# Altium project SCB.PrjPCB (part 6 of 6)
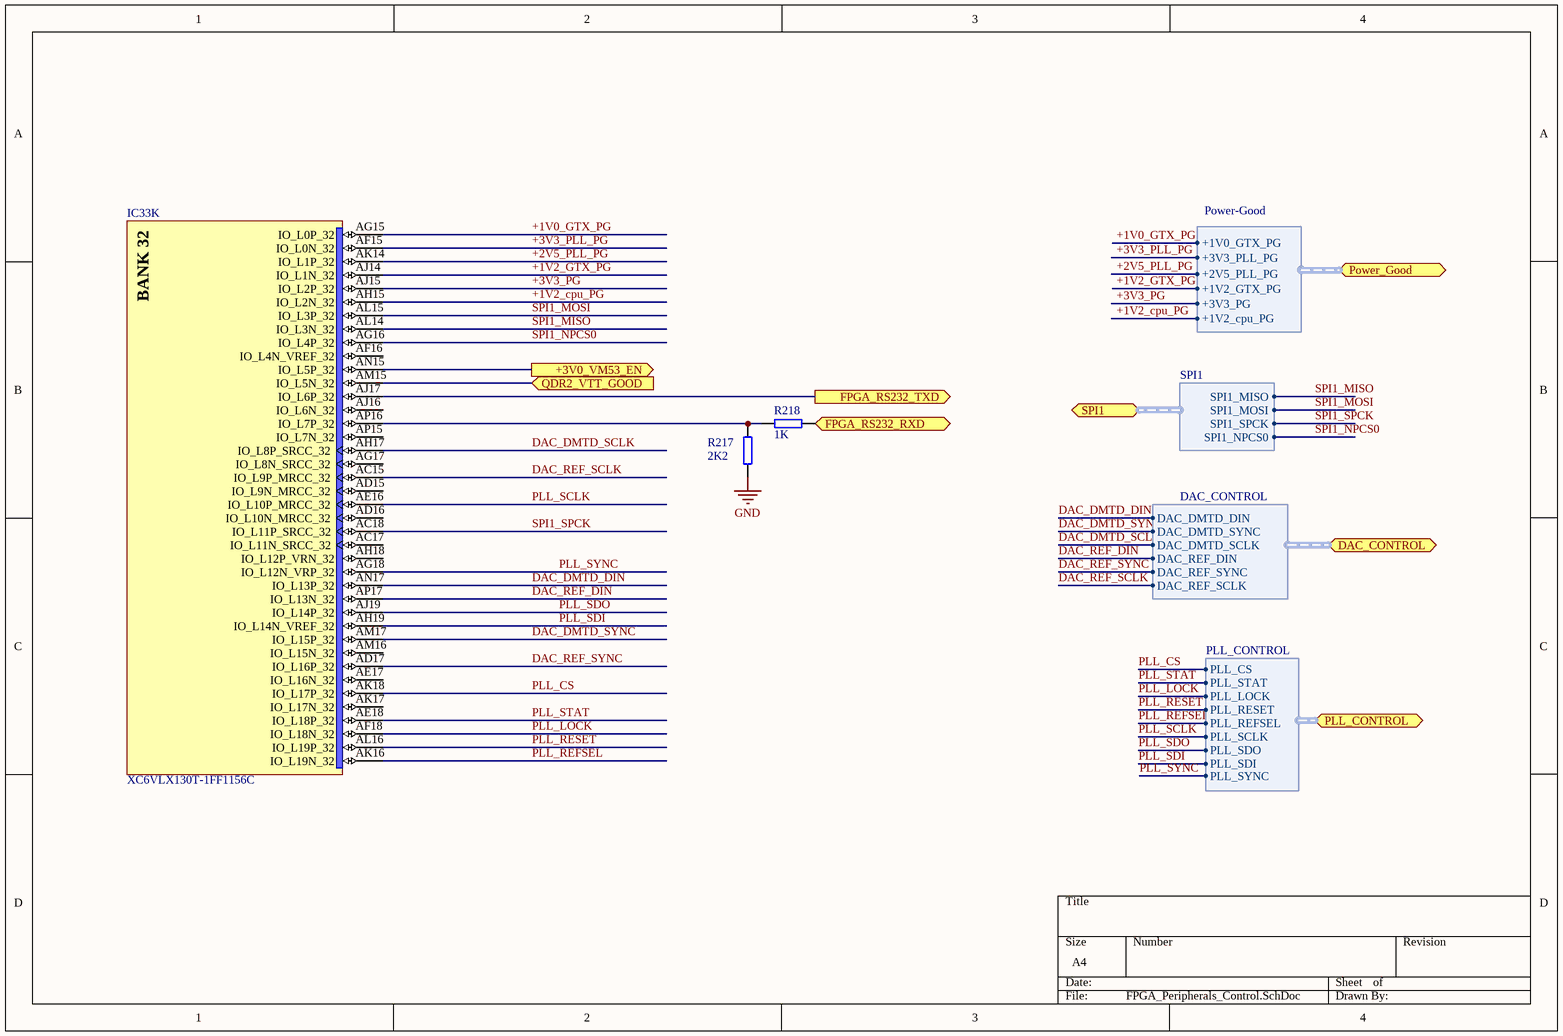
[diagram p23: FPGA_Peripherals_Control.SchDoc]

## Nets that join several sheets
+1V0: Power_Supply (10 pins), FPGA_POWER_DGND (65 pins)
+1V0_GTX: FPGA_GTX (36 pins), FPGA_System_Monitor (R126.2), Power_Supply (C311.2 C312.2 IC39.8 R205.2)
+1V2_cpu: CPU_JTAG_Power_PLL (8 pins), FPGA_System_Monitor (R107.2), Power_Supply (C285.2 C286.2 IC37.8 R198.2)
+1V2_GTX: FPGA_GTX (39 pins), FPGA_System_Monitor (R117.2), Power_Supply (C246.2 C247.2 IC32.8 R180.2)
+1V5: FPGA_System_Monitor (R106.2), Power_Supply (13 pins)
+1V8: CPU_JTAG_Power_PLL (7 pins), CPU_100M_Ethernet (8 pins), External WatchDogs (C28.2 IC3.10 R16.2), FPGA_Configuration (C62.2 C63.2 IC36.A6 IC36.H3), FPGA_System_Monitor (R138.2), Power_Supply (9 pins), FPGA_POWER_DGND (42 pins), QDRII_mem (IC42.P6 IC42.R6 IC43.P6 IC43.R6), QDRII_power (104 pins), FPGA_QDRII (R95.2 R97.2)
+2V5: Connectors (5 pins), SMI_Link_7-12 (J3.29 J3.31), External WatchDogs (R17.2 R18.2 R19.2), FPGA_Configuration (23 pins), CPU_IO_Ports (C217.2 IC24.2 IC24.10), FPGA_System_Monitor (R128.2 R129.2), Power_Supply (24 pins), FPGA_POWER_DGND (55 pins), QDRII_power (C417.1 IC45.7 IC45.10 R214.2)
+2V5_PLL: SCB_PLLs (7 pins), Power_Supply (C263.2 C264.2 IC34.8 R188.1)
+3V0_OSC: SCB_CLKs (5 pins), Power_Supply (C235.2 IC38.5)
+3V0_VM53: SCB_CLKs (C33.1 C35.1 IC4.4 IC23.4), Power_Supply (C236.2 IC44.5)
+3V3: Connectors (6 pins), CPU_JTAG_Power_PLL (24 pins), RS232_and_USB_ports (C242.1 C244.1 IC31.16), SCB_CLKs (19 pins), CPU_100M_Ethernet (L12.2 R201.2), CPU_Memory (40 pins), External WatchDogs (6 pins), CPU_IO_Ports (5 pins), SCB_PLLs (22 pins), FPGA_System_Monitor (12 pins), Power_Supply (11 pins)
+3V3_PLL: SCB_PLLs (27 pins), Power_Supply (C266.2 C267.2 IC35.8 R189.1)
+5VCC_IN: Connectors (17 pins), Power_Supply (42 pins)
GND: Connectors (67 pins), CPU_JTAG_Power_PLL (53 pins), RS232_and_USB_ports (6 pins), SCB_CLKs (51 pins), FPGA_CPU_EBI1 (R182.1), FPGA_GTX (41 pins), CPU_100M_Ethernet (R187.2 R192.2), CPU_Memory (36 pins), SMI_Link_7-12 (J3.33 J3.34 J3.35 J3.36), uTCA_Tongue3 (58 pins), External WatchDogs (8 pins), FPGA_Configuration (18 pins), CPU_IO_Ports (C217.1 C218.1 D14.2 IC24.11), SCB_PLLs (82 pins), FPGA_System_Monitor (27 pins), Power_Supply (114 pins), FPGA_POWER_DGND (275 pins), QDRII_mem (IC42.R2 IC43.R2), QDRII_power (139 pins), FPGA_QDRII (R94.2 R96.2), FPGA_Peripherals_Control (R217.2)
GND_ETH: Connectors (CN1.9 CN1.12), CPU_100M_Ethernet (26 pins)
QDRII_VTT: QDRII_mem (28 pins), QDRII_power (37 pins)
VREFQDRII: QDRII_power (11 pins), FPGA_QDRII (8 pins)
+1V0_GTX_PG: Power_Supply (IC39.2 R207.2), FPGA_Peripherals_Control (IC33.AG15)
+1V2_cpu_PG: Power_Supply (IC37.2 IC47.24 IC48.4 R195.1), FPGA_Peripherals_Control (IC33.AH15)
+1V2_GTX_PG: Power_Supply (IC32.2 R181.2), FPGA_Peripherals_Control (IC33.AJ14)
+2V5_PLL_PG: Power_Supply (IC34.2 R190.2), FPGA_Peripherals_Control (IC33.AK14)
+3V0_VM53_EN: Power_Supply (IC44.3 R211.1), FPGA_Peripherals_Control (IC33.AN15)
+3V3_PG: Power_Supply (IC48.2 R239.2), FPGA_Peripherals_Control (IC33.AJ15)
+3V3_PLL_PG: Power_Supply (IC35.2 R191.2), FPGA_Peripherals_Control (IC33.AF15)
ARM_DMARQ: FPGA_Configuration (IC33.AC22 R52.2), CPU_IO_Ports (IC1#1.H16)
ARM_FPGA_RESET: FPGA_Configuration (IC33.M10 R184.2), CPU_IO_Ports (IC1#1.E17)
ARM_IRQ: FPGA_Configuration (IC33.AC24 R53.2), CPU_IO_Ports (IC1#1.K15)
ARM_NRST: CPU_JTAG_Power_PLL (D6.1 D6.2), FPGA_Configuration (IC33.AD22 R51.2)
ARM_PROGRAM_B: FPGA_Configuration (D10.2), CPU_IO_Ports (IC1#1.L16)
ARM_WD_RST: CPU_JTAG_Power_PLL (D5.1), External WatchDogs (IC2.4 S1.1)
CLK125MHZ_EXT_N: SCB_CLKs (IC9.6 R23.2), SCB_PLLs (C179.1)
CLK125MHZ_EXT_P: SCB_CLKs (IC9.7 R24.2), SCB_PLLs (C182.1)
CLK_25MHz: SCB_CLKs (IC21.5 IC22.3), SCB_PLLs (IC14.21)
CPU_JTAG.JNRST: Connectors (P6.15), CPU_JTAG_Power_PLL (D5.3 D6.3 IC1#1.V15 R11.1)
CPU_JTAG.JNTRST: Connectors (P6.3), CPU_JTAG_Power_PLL (IC1#1.U16 R3.1 R7.1)
CPU_JTAG.JRTCK: Connectors (P6.11), CPU_JTAG_Power_PLL (IC1#1.U15 R10.1)
CPU_JTAG.JTCK: Connectors (P6.9), CPU_JTAG_Power_PLL (IC1#1.R17)
CPU_JTAG.JTDI: Connectors (P6.5), CPU_JTAG_Power_PLL (IC1#1.P17 R8.1)
CPU_JTAG.JTDO: Connectors (P6.13), CPU_JTAG_Power_PLL (IC1#1.N18)
CPU_JTAG.JTMS: Connectors (P6.7), CPU_JTAG_Power_PLL (IC1#1.N17 R9.1)
CPU_SSC.RD1: Connectors (J2.23), CPU_IO_Ports (IC1#1.J13)
CPU_SSC.RF1: Connectors (J2.27), CPU_IO_Ports (IC1#1.J12)
CPU_SSC.RK1: Connectors (J2.25), CPU_IO_Ports (IC1#1.J14)
CPU_SSC.TD1: Connectors (J2.21), CPU_IO_Ports (IC1#1.J18)
CPU_SSC.TF1: Connectors (J2.17), CPU_IO_Ports (IC1#1.J16)
CPU_SSC.TK1: Connectors (J2.19), CPU_IO_Ports (IC1#1.J17)
DAC_CONTROL.DAC_DMTD_DIN: SCB_CLKs (R148.2), FPGA_Peripherals_Control (IC33.AN17)
DAC_CONTROL.DAC_DMTD_SCLK: SCB_CLKs (R149.2), FPGA_Peripherals_Control (IC33.AH17)
DAC_CONTROL.DAC_DMTD_SYNC: SCB_CLKs (R150.2), FPGA_Peripherals_Control (IC33.AM17)
DAC_CONTROL.DAC_REF_DIN: SCB_CLKs (R21.2), FPGA_Peripherals_Control (IC33.AP17)
DAC_CONTROL.DAC_REF_SCLK: SCB_CLKs (R140.2), FPGA_Peripherals_Control (IC33.AC15)
DAC_CONTROL.DAC_REF_SYNC: SCB_CLKs (R141.2), FPGA_Peripherals_Control (IC33.AD17)
DMTD_CLK_N: FPGA_Configuration (IC33.M22), SCB_PLLs (IC13.5)
DMTD_CLK_P: FPGA_Configuration (IC33.L23), SCB_PLLs (IC13.6)
DMTDCLK_mB_N: Connectors (J1.95), SCB_PLLs (IC13.2)
DMTDCLK_mB_P: Connectors (J1.93), SCB_PLLs (IC13.3)
ETH_100MHz.LED_ACT: Connectors (CN1.10), CPU_100M_Ethernet (IC41.3)
ETH_100MHz.LED_LINK: Connectors (CN1.11), CPU_100M_Ethernet (IC41.2 R199.2)
ETH_100MHz.RX_N: Connectors (CN1.6), CPU_100M_Ethernet (Tr1.9)
ETH_100MHz.RX_P: Connectors (CN1.3), CPU_100M_Ethernet (Tr1.11)
ETH_100MHz.SHIELD: Connectors (CN1.0), CPU_100M_Ethernet (C214.1 Tr1.10 Tr1.15)
ETH_100MHz.TX_N: Connectors (CN1.2), CPU_100M_Ethernet (Tr1.14)
ETH_100MHz.TX_P: Connectors (CN1.1), CPU_100M_Ethernet (Tr1.16)
EXT_PROGRAM_B: Connectors (J1.85), FPGA_Configuration (D9.1)
FPGA_25MHZ_CLK_N: SCB_CLKs (IC21.3), FPGA_Configuration (IC33.K23)
FPGA_25MHZ_CLK_P: SCB_CLKs (IC21.4), FPGA_Configuration (IC33.K24)
FPGA_CCLK: FPGA_Configuration (R158.1), CPU_IO_Ports (IC1#1.K16)
FPGA_DIN: FPGA_Configuration (R179.2), CPU_IO_Ports (IC1#1.K18)
FPGA_DONE: Connectors (J1.87), FPGA_Configuration (Q1.3), CPU_IO_Ports (D13.2 IC1#1.L17)
FPGA_GCLK_N: Connectors (J1.91), FPGA_System_Monitor (IC33.E11)
FPGA_GCLK_P: Connectors (J1.89), FPGA_System_Monitor (IC33.D11)
FPGA_GPIO0: Connectors (J2.2), FPGA_GPIOs (IC33.AC25)
FPGA_GPIO1: Connectors (J2.4), FPGA_GPIOs (IC33.AB25)
FPGA_GPIO2: Connectors (J2.6), FPGA_GPIOs (IC33.AF31)
FPGA_GPIO3: Connectors (J2.8), FPGA_GPIOs (IC33.AG31)
FPGA_GPIO4: Connectors (J2.10), FPGA_GPIOs (IC33.AB26)
FPGA_GPIO5: Connectors (J2.12), FPGA_GPIOs (IC33.AA26)
FPGA_GPIO6: Connectors (J2.14), FPGA_GPIOs (IC33.AG32)
FPGA_GPIO7: Connectors (J2.16), FPGA_GPIOs (IC33.AG33)
FPGA_GPIO8: Connectors (J2.18), FPGA_GPIOs (IC33.AC27)
FPGA_GPIO9: Connectors (J2.20), FPGA_GPIOs (IC33.AB27)
FPGA_GPIO10: Connectors (J2.22), FPGA_GPIOs (IC33.AE32)
FPGA_GPIO11: Connectors (J2.24), FPGA_GPIOs (IC33.AD32)
FPGA_GPIO12: Connectors (J2.26), FPGA_GPIOs (IC33.AC28)
FPGA_GPIO13: Connectors (J2.28), FPGA_GPIOs (IC33.AB28)
FPGA_GPIO14: Connectors (J2.30), FPGA_GPIOs (IC33.AC32)
FPGA_GPIO15: Connectors (J2.32), FPGA_GPIOs (IC33.AB32)
FPGA_GPIO16: Connectors (J2.34), FPGA_GPIOs (IC33.AC29)
FPGA_GPIO17: Connectors (J2.36), FPGA_GPIOs (IC33.AD29)
FPGA_GPIO18: Connectors (J2.38), FPGA_GPIOs (IC33.AF33)
FPGA_GPIO19: Connectors (J2.40), FPGA_GPIOs (IC33.AE33)
FPGA_GPIO20: Connectors (J2.42), FPGA_GPIOs (IC33.AC30)
FPGA_GPIO21: Connectors (J2.44), FPGA_GPIOs (IC33.AD30)
FPGA_GPIO22: Connectors (J2.46), FPGA_GPIOs (IC33.AF34)
FPGA_GPIO23: Connectors (J2.48), FPGA_GPIOs (IC33.AE34)
FPGA_GPIO24: Connectors (J2.50), FPGA_GPIOs (IC33.AA29)
FPGA_GPIO25: Connectors (J2.52), FPGA_GPIOs (IC33.AA28)
FPGA_GPIO26: Connectors (J2.54), FPGA_GPIOs (IC33.Y26)
FPGA_GPIO27: Connectors (J2.56), FPGA_GPIOs (IC33.AA25)
FPGA_GPIO28: Connectors (J2.58), FPGA_GPIOs (IC33.AD31)
FPGA_GPIO29: Connectors (J2.60), FPGA_GPIOs (IC33.AE31)
FPGA_GPIO30: Connectors (J2.62), FPGA_GPIOs (IC33.AB33)
FPGA_GPIO31: Connectors (J2.64), FPGA_GPIOs (IC33.AC33)
FPGA_GPIO32: Connectors (J2.66), FPGA_GPIOs (IC33.AB31)
FPGA_GPIO33: Connectors (J2.68), FPGA_GPIOs (IC33.AB30)
FPGA_GPIO34: Connectors (J2.70), FPGA_GPIOs (IC33.AC34)
FPGA_GPIO35: Connectors (J2.72), FPGA_GPIOs (IC33.AD34)
FPGA_GPIO36: Connectors (J2.74), FPGA_GPIOs (IC33.AA31)
FPGA_GPIO37: Connectors (J2.76), FPGA_GPIOs (IC33.AA30)
FPGA_GPIO38: Connectors (J2.78), FPGA_GPIOs (IC33.AA33)
FPGA_GPIO39: Connectors (J2.80), FPGA_GPIOs (IC33.AA34)
FPGA_INIT_B: Connectors (J1.83), FPGA_Configuration (Q2.2), CPU_IO_Ports (IC1#1.L18 R163.1)
FPGA_JTAG.FPGA_TCK: Connectors (P5.6), FPGA_Configuration (IC33.AE8)
FPGA_JTAG.FPGA_TDI: Connectors (P5.8), FPGA_Configuration (IC33.AD8)
FPGA_JTAG.FPGA_TDO: Connectors (P5.10), FPGA_Configuration (IC33.AC8)
FPGA_JTAG.FPGA_TMS: Connectors (P5.4), FPGA_Configuration (IC33.AF8)
FPGA_RS232_RXD: RS232_and_USB_ports (IC31.9), FPGA_Peripherals_Control (R218.1)
FPGA_RS232_TXD: RS232_and_USB_ports (IC31.10), FPGA_Peripherals_Control (IC33.AJ17)
FPGA_WD.FPGA_WD_INT: External WatchDogs (IC3.8 R17.1), FPGA_Configuration (IC33.AC23)
FPGA_WD.FPGA_WD_PROGRAM: External WatchDogs (IC3.4 S2.2), FPGA_Configuration (D9.2)
FPGA_WD.FPGA_WD_SCL: External WatchDogs (IC3.7 R19.1), FPGA_Configuration (IC33.T24)
FPGA_WD.FPGA_WD_SDA: External WatchDogs (IC3.6 R18.1), FPGA_Configuration (IC33.T23)
FREE_GC1_N: SMI_Link_7-12 (J3.30), FPGA_System_Monitor (IC33.K12)
FREE_GC1_P: SMI_Link_7-12 (J3.32), FPGA_System_Monitor (IC33.K13)
MGTREFCLK.MGTREFCLK112_N: FPGA_GTX (IC33.AK5), SCB_PLLs (C138.1)
MGTREFCLK.MGTREFCLK112_P: FPGA_GTX (IC33.AK6), SCB_PLLs (C139.1)
MGTREFCLK.MGTREFCLK113_N: FPGA_GTX (IC33.AD5), SCB_PLLs (C122.1)
MGTREFCLK.MGTREFCLK113_P: FPGA_GTX (IC33.AD6), SCB_PLLs (C125.1)
MGTREFCLK.MGTREFCLK114_N: FPGA_GTX (IC33.V5), SCB_PLLs (C102.1)
MGTREFCLK.MGTREFCLK114_P: FPGA_GTX (IC33.V6), SCB_PLLs (C103.1)
MGTREFCLK.MGTREFCLK115_N: FPGA_GTX (IC33.P5), SCB_PLLs (C99.1)
MGTREFCLK.MGTREFCLK115_P: FPGA_GTX (IC33.P6), SCB_PLLs (C101.1)
MGTREFCLK.MGTREFCLK116_N: FPGA_GTX (IC33.H5), SCB_PLLs (C89.1)
MGTREFCLK.MGTREFCLK116_P: FPGA_GTX (IC33.H6), SCB_PLLs (C90.1)
MGTRX112_0_N: Connectors (J1.3), FPGA_GTX (IC33.AP6)
MGTRX112_0_P: Connectors (J1.1), FPGA_GTX (IC33.AP5)
MGTRX112_1_N: Connectors (J1.7), FPGA_GTX (IC33.AM6)
MGTRX112_1_P: Connectors (J1.5), FPGA_GTX (IC33.AM5)
MGTRX112_2_N: Connectors (J1.11), FPGA_GTX (IC33.AL4)
MGTRX112_2_P: Connectors (J1.9), FPGA_GTX (IC33.AL3)
MGTRX112_3_N: Connectors (J1.15), FPGA_GTX (IC33.AJ4)
MGTRX112_3_P: Connectors (J1.13), FPGA_GTX (IC33.AJ3)
MGTRX113_0_N: Connectors (J1.19), FPGA_GTX (IC33.AG4)
MGTRX113_0_P: Connectors (J1.17), FPGA_GTX (IC33.AG3)
MGTRX113_1_N: Connectors (J1.23), FPGA_GTX (IC33.AF6)
MGTRX113_1_P: Connectors (J1.21), FPGA_GTX (IC33.AF5)
MGTRX113_2_N: Connectors (J1.27), FPGA_GTX (IC33.AE4)
MGTRX113_2_P: Connectors (J1.25), FPGA_GTX (IC33.AE3)
MGTRX113_3_N: Connectors (J1.31), FPGA_GTX (IC33.AC4)
MGTRX113_3_P: Connectors (J1.29), FPGA_GTX (IC33.AC3)
MGTRX114_0_N: Connectors (J1.35), FPGA_GTX (IC33.AA4)
MGTRX114_0_P: Connectors (J1.33), FPGA_GTX (IC33.AA3)
MGTRX114_1_N: Connectors (J1.39), FPGA_GTX (IC33.W4)
MGTRX114_1_P: Connectors (J1.37), FPGA_GTX (IC33.W3)
MGTRX114_2_N: Connectors (J1.43), FPGA_GTX (IC33.U4)
MGTRX114_2_P: Connectors (J1.41), FPGA_GTX (IC33.U3)
MGTRX114_3_N: Connectors (J1.47), FPGA_GTX (IC33.R4)
MGTRX114_3_P: Connectors (J1.45), FPGA_GTX (IC33.R3)
MGTRX115_0_N: Connectors (J1.51), FPGA_GTX (IC33.N4)
MGTRX115_0_P: Connectors (J1.49), FPGA_GTX (IC33.N3)
MGTRX115_1_N: Connectors (J1.55), FPGA_GTX (IC33.L4)
MGTRX115_1_P: Connectors (J1.53), FPGA_GTX (IC33.L3)
MGTRX115_2_N: Connectors (J1.59), FPGA_GTX (IC33.K6)
MGTRX115_2_P: Connectors (J1.57), FPGA_GTX (IC33.K5)
MGTRX115_3_N: Connectors (J1.63), FPGA_GTX (IC33.J4)
MGTRX115_3_P: Connectors (J1.61), FPGA_GTX (IC33.J3)
MGTRX116_0_N: Connectors (J1.67), FPGA_GTX (IC33.G4)
MGTRX116_0_P: Connectors (J1.65), FPGA_GTX (IC33.G3)
MGTRX116_1_N: Connectors (J1.71), FPGA_GTX (IC33.E4)
MGTRX116_1_P: Connectors (J1.69), FPGA_GTX (IC33.E3)
MGTRX116_2_N: Connectors (J1.75), FPGA_GTX (IC33.D6)
MGTRX116_2_P: Connectors (J1.73), FPGA_GTX (IC33.D5)
MGTRX116_3_N: Connectors (J1.79), FPGA_GTX (IC33.B6)
MGTRX116_3_P: Connectors (J1.77), FPGA_GTX (IC33.B5)
MGTTX112_0_N: Connectors (J1.4), FPGA_GTX (IC33.AP2)
MGTTX112_0_P: Connectors (J1.2), FPGA_GTX (IC33.AP1)
MGTTX112_1_N: Connectors (J1.8), FPGA_GTX (IC33.AN4)
MGTTX112_1_P: Connectors (J1.6), FPGA_GTX (IC33.AN3)
MGTTX112_2_N: Connectors (J1.12), FPGA_GTX (IC33.AM2)
MGTTX112_2_P: Connectors (J1.10), FPGA_GTX (IC33.AM1)
MGTTX112_3_N: Connectors (J1.16), FPGA_GTX (IC33.AK2)
MGTTX112_3_P: Connectors (J1.14), FPGA_GTX (IC33.AK1)
MGTTX113_0_N: Connectors (J1.20), FPGA_GTX (IC33.AH2)
MGTTX113_0_P: Connectors (J1.18), FPGA_GTX (IC33.AH1)
MGTTX113_1_N: Connectors (J1.24), FPGA_GTX (IC33.AF2)
MGTTX113_1_P: Connectors (J1.22), FPGA_GTX (IC33.AF1)
MGTTX113_2_N: Connectors (J1.28), FPGA_GTX (IC33.AD2)
MGTTX113_2_P: Connectors (J1.26), FPGA_GTX (IC33.AD1)
MGTTX113_3_N: Connectors (J1.32), FPGA_GTX (IC33.AB2)
MGTTX113_3_P: Connectors (J1.30), FPGA_GTX (IC33.AB1)
MGTTX114_0_N: Connectors (J1.36), FPGA_GTX (IC33.Y2)
MGTTX114_0_P: Connectors (J1.34), FPGA_GTX (IC33.Y1)
MGTTX114_1_N: Connectors (J1.40), FPGA_GTX (IC33.V2)
MGTTX114_1_P: Connectors (J1.38), FPGA_GTX (IC33.V1)
MGTTX114_2_N: Connectors (J1.44), FPGA_GTX (IC33.T2)
MGTTX114_2_P: Connectors (J1.42), FPGA_GTX (IC33.T1)
MGTTX114_3_N: Connectors (J1.48), FPGA_GTX (IC33.P2)
MGTTX114_3_P: Connectors (J1.46), FPGA_GTX (IC33.P1)
MGTTX115_0_N: Connectors (J1.52), FPGA_GTX (IC33.M2)
MGTTX115_0_P: Connectors (J1.50), FPGA_GTX (IC33.M1)
MGTTX115_1_N: Connectors (J1.56), FPGA_GTX (IC33.K2)
MGTTX115_1_P: Connectors (J1.54), FPGA_GTX (IC33.K1)
MGTTX115_2_N: Connectors (J1.60), FPGA_GTX (IC33.H2)
MGTTX115_2_P: Connectors (J1.58), FPGA_GTX (IC33.H1)
MGTTX115_3_N: Connectors (J1.64), FPGA_GTX (IC33.F2)
MGTTX115_3_P: Connectors (J1.62), FPGA_GTX (IC33.F1)
MGTTX116_0_N: Connectors (J1.68), FPGA_GTX (IC33.D2)
MGTTX116_0_P: Connectors (J1.66), FPGA_GTX (IC33.D1)
MGTTX116_1_N: Connectors (J1.72), FPGA_GTX (IC33.C4)
MGTTX116_1_P: Connectors (J1.70), FPGA_GTX (IC33.C3)
MGTTX116_2_N: Connectors (J1.76), FPGA_GTX (IC33.B2)
MGTTX116_2_P: Connectors (J1.74), FPGA_GTX (IC33.B1)
MGTTX116_3_N: Connectors (J1.80), FPGA_GTX (IC33.A4)
MGTTX116_3_P: Connectors (J1.78), FPGA_GTX (IC33.A3)
NetC46_1: Connectors (P4.1), SCB_CLKs (C46.1 R25.2 R26.2)
NetC154_2: SCB_CLKs (IC7.4), SCB_PLLs (C154.2)
NetC185_1: SCB_CLKs (IC4.3 IC23.3), SCB_PLLs (C185.1)
NetD5_2: Connectors (J2.31), CPU_JTAG_Power_PLL (D5.2)
NetIC1#1_A11: Connectors (P2.5), CPU_IO_Ports (IC1#1.A11)
NetIC1#1_E10: Connectors (P2.3), CPU_IO_Ports (IC1#1.E10)
NetIC1#1_H12: External WatchDogs (IC2.8 R13.1), CPU_IO_Ports (IC1#1.H12)
NetIC1#1_J15: External WatchDogs (IC2.7 R15.1), CPU_IO_Ports (IC1#1.J15)
NetIC1#1_K14: Connectors (J2.29), CPU_IO_Ports (IC1#1.K14)
NetIC1#1_L14: External WatchDogs (IC2.6 R14.1), CPU_IO_Ports (IC1#1.L14)
NetIC5_3: SCB_CLKs (IC5.3 IC5.4 R20.1), FPGA_System_Monitor (R139.2)
NetIC8_3: SCB_CLKs (IC8.3 IC8.4 R22.1), FPGA_System_Monitor (R127.2)
NetIC12_2: Connectors (P8.1), SCB_CLKs (IC12.2 R42.1)
NetIC26_1: Connectors (J2.15), CPU_Memory (IC26.1 R170.1)
NetIC33_J25: SCB_CLKs (R39.2 R40.2), FPGA_Configuration (IC33.J25)
NetP1_1: Connectors (P1.1), SCB_PLLs (R77.2)
NetP3_1: Connectors (P3.1), SCB_CLKs (R41.2)
NetP7_1: Connectors (P7.1), SCB_CLKs (R152.2 Tr2.6)
NetP7_2: Connectors (P7.2), SCB_CLKs (R153.2 Tr2.4)
PC0: Connectors (J2.33), CPU_IO_Ports (IC1#1.E16)
PC1: Connectors (J2.35), CPU_IO_Ports (IC1#1.D17)
PC2: Connectors (J2.37), CPU_IO_Ports (IC1#1.D16)
PC3: Connectors (J2.39), CPU_IO_Ports (IC1#1.C15)
PC4: Connectors (J2.41), CPU_IO_Ports (IC1#1.E14)
PC5: Connectors (J2.43), CPU_IO_Ports (IC1#1.B16)
PC6: Connectors (J2.45), CPU_IO_Ports (IC1#1.D13)
PC7: Connectors (J2.47), CPU_IO_Ports (IC1#1.B15)
PC8: Connectors (J2.49), CPU_IO_Ports (IC1#1.C14)
PC9: Connectors (J2.51), CPU_IO_Ports (IC1#1.B14)
PC10: Connectors (J2.53), CPU_IO_Ports (IC1#1.D15)
PC11: Connectors (J2.55), CPU_IO_Ports (IC1#1.E13)
PC12: Connectors (J2.57), CPU_IO_Ports (IC1#1.A15)
PC13: Connectors (J2.59), CPU_IO_Ports (IC1#1.F13)
PC14: Connectors (J2.61), CPU_IO_Ports (IC1#1.C13)
PC15: Connectors (J2.63), CPU_IO_Ports (IC1#1.E12)
PCK3: FPGA_CPU_EBI1 (R183.1), CPU_IO_Ports (IC1#1.M4)
PE0: Connectors (J1.82), CPU_IO_Ports (IC1#1.K3)
PE1: Connectors (J1.84), CPU_IO_Ports (IC1#1.K4)
PE2: Connectors (J1.86), CPU_IO_Ports (IC1#1.L6)
PE3: Connectors (J1.88), CPU_IO_Ports (IC1#1.L7)
PE4: Connectors (J1.90), CPU_IO_Ports (IC1#1.L2)
PE5: Connectors (J1.92), CPU_IO_Ports (IC1#1.L5)
PE6: Connectors (J1.94), CPU_IO_Ports (IC1#1.K1)
PE7: Connectors (J1.96), CPU_IO_Ports (IC1#1.L4)
PLL_CONTROL.PLL_CS: SCB_PLLs (IC16.17), FPGA_Peripherals_Control (IC33.AK18)
PLL_CONTROL.PLL_LOCK: SCB_PLLs (R219.1 R220.2), FPGA_Peripherals_Control (IC33.AF18)
PLL_CONTROL.PLL_REFSEL: SCB_PLLs (IC16.7), FPGA_Peripherals_Control (IC33.AK16)
PLL_CONTROL.PLL_RESET: SCB_PLLs (IC13.12 IC14.12 IC16.23), FPGA_Peripherals_Control (IC33.AL16)
PLL_CONTROL.PLL_SCLK: SCB_PLLs (IC16.16), FPGA_Peripherals_Control (IC33.AE16)
PLL_CONTROL.PLL_SDI: SCB_PLLs (R222.1 R224.2), FPGA_Peripherals_Control (IC33.AH19)
PLL_CONTROL.PLL_SDO: SCB_PLLs (R221.1 R223.2), FPGA_Peripherals_Control (IC33.AJ19)
PLL_CONTROL.PLL_STAT: SCB_PLLs (R225.2 R226.1), FPGA_Peripherals_Control (IC33.AE18)
PLL_CONTROL.PLL_SYNC: SCB_PLLs (IC16.8), FPGA_Peripherals_Control (IC33.AG18)
PPS_OUT: SCB_CLKs (IC12.5), FPGA_Configuration (IC33.U23)
Q1_A0: QDRII_mem (IC42.B4 RP5.2), FPGA_QDRII (IC33.G20)
Q1_A1: QDRII_mem (IC42.B8 RP5.3), FPGA_QDRII (IC33.C19)
Q1_A2: QDRII_mem (IC42.C5 RP5.4), FPGA_QDRII (IC33.F20)
Q1_A3: QDRII_mem (IC42.C6 RP5.5), FPGA_QDRII (IC33.F19)
Q1_A4: QDRII_mem (IC42.C7 RP5.7), FPGA_QDRII (IC33.A21)
Q1_A5: QDRII_mem (IC42.N5 RP5.8), FPGA_QDRII (IC33.A20)
Q1_A6: QDRII_mem (IC42.N6 RP5.9), FPGA_QDRII (IC33.E23)
Q1_A7: QDRII_mem (IC42.N7 RP5.10), FPGA_QDRII (IC33.E22)
Q1_A8: QDRII_mem (IC42.P4 RP3.2), FPGA_QDRII (IC33.B22)
Q1_A9: QDRII_mem (IC42.P5 RP3.3), FPGA_QDRII (IC33.B21)
Q1_A10: QDRII_mem (IC42.P7 RP3.4), FPGA_QDRII (IC33.J20)
Q1_A11: QDRII_mem (IC42.P8 RP3.5), FPGA_QDRII (IC33.C23)
Q1_A12: QDRII_mem (IC42.R3 RP3.7), FPGA_QDRII (IC33.B23)
Q1_A13: QDRII_mem (IC42.R4 RP3.8), FPGA_QDRII (IC33.G22)
Q1_A14: QDRII_mem (IC42.R5 RP3.9), FPGA_QDRII (IC33.G21)
Q1_A15: QDRII_mem (IC42.R7 RP3.10), FPGA_QDRII (IC33.A24)
Q1_A16: QDRII_mem (IC42.R8 RP1.2), FPGA_QDRII (IC33.A23)
Q1_A17: QDRII_mem (IC42.R9 RP1.3), FPGA_QDRII (IC33.D20)
Q1_A18: QDRII_mem (IC42.A9 RP1.4), FPGA_QDRII (IC33.C20)
Q1_BWS0: QDRII_mem (IC42.B7), FPGA_QDRII (IC33.K17)
Q1_BWS1: QDRII_mem (IC42.A7), FPGA_QDRII (IC33.M17)
Q1_BWS2: QDRII_mem (IC42.A5), FPGA_QDRII (IC33.G16)
Q1_BWS3: QDRII_mem (IC42.B5), FPGA_QDRII (IC33.M15)
Q1_CQ_N: QDRII_mem (IC42.A1), FPGA_QDRII (IC33.F21)
Q1_CQ_P: QDRII_mem (IC42.A11), FPGA_QDRII (IC33.B20)
Q1_D0: QDRII_mem (IC42.P10 RP13.10), FPGA_QDRII (IC33.F18)
Q1_D1: QDRII_mem (IC42.N11 RP13.9), FPGA_QDRII (IC33.E17)
Q1_D2: QDRII_mem (IC42.M11 RP13.8), FPGA_QDRII (IC33.E18)
Q1_D3: QDRII_mem (IC42.K10 RP13.7), FPGA_QDRII (IC33.D17)
Q1_D4: QDRII_mem (IC42.J11 RP13.5), FPGA_QDRII (IC33.K18)
Q1_D5: QDRII_mem (IC42.G11 RP13.4), FPGA_QDRII (IC33.H17)
Q1_D6: QDRII_mem (IC42.E10 RP13.3), FPGA_QDRII (IC33.G17)
Q1_D7: QDRII_mem (IC42.D11 RP13.2), FPGA_QDRII (IC33.L19)
Q1_D8: QDRII_mem (IC42.C11 RP11.10), FPGA_QDRII (IC33.L18)
Q1_D9: QDRII_mem (IC42.N10 RP11.9), FPGA_QDRII (IC33.C17)
Q1_D10: QDRII_mem (IC42.M9 RP11.8), FPGA_QDRII (IC33.B17)
Q1_D11: QDRII_mem (IC42.L9 RP11.7), FPGA_QDRII (IC33.K19)
Q1_D12: QDRII_mem (IC42.J9 RP11.5), FPGA_QDRII (IC33.J19)
Q1_D13: QDRII_mem (IC42.G10 RP11.4), FPGA_QDRII (IC33.M18)
Q1_D14: QDRII_mem (IC42.F9 RP11.3), FPGA_QDRII (IC33.G18)
Q1_D15: QDRII_mem (IC42.D10 RP11.2), FPGA_QDRII (IC33.H18)
Q1_D16: QDRII_mem (IC42.C9 RP9.10), FPGA_QDRII (IC33.K16)
Q1_D17: QDRII_mem (IC42.B9 RP9.9), FPGA_QDRII (IC33.L16)
Q1_D18: QDRII_mem (IC42.B3 RP9.8), FPGA_QDRII (IC33.L15)
Q1_D19: QDRII_mem (IC42.C3 RP9.7), FPGA_QDRII (IC33.L14)
Q1_D20: QDRII_mem (IC42.D2 RP9.5), FPGA_QDRII (IC33.A16)
Q1_D21: QDRII_mem (IC42.F3 RP9.4), FPGA_QDRII (IC33.B16)
Q1_D22: QDRII_mem (IC42.G2 RP9.3), FPGA_QDRII (IC33.F16)
Q1_D23: QDRII_mem (IC42.J3 RP9.2), FPGA_QDRII (IC33.E16)
Q1_D24: QDRII_mem (IC42.L3 RP8.10), FPGA_QDRII (IC33.D16)
Q1_D25: QDRII_mem (IC42.M3 RP8.9), FPGA_QDRII (IC33.J17)
Q1_D26: QDRII_mem (IC42.N2 RP8.8), FPGA_QDRII (IC33.J16)
Q1_D27: QDRII_mem (IC42.C1 RP8.7), FPGA_QDRII (IC33.A15)
Q1_D28: QDRII_mem (IC42.D1 RP8.5), FPGA_QDRII (IC33.B15)
Q1_D29: QDRII_mem (IC42.E2 RP8.4), FPGA_QDRII (IC33.G15)
Q1_D30: QDRII_mem (IC42.G1 RP8.3), FPGA_QDRII (IC33.F15)
Q1_D31: QDRII_mem (IC42.J1 RP8.2), FPGA_QDRII (IC33.M16)
Q1_D32: QDRII_mem (IC42.K2 RP1.7), FPGA_QDRII (IC33.H15)
Q1_D33: QDRII_mem (IC42.M1 RP1.8), FPGA_QDRII (IC33.J15)
Q1_D34: QDRII_mem (IC42.N1 RP1.9), FPGA_QDRII (IC33.D15)
Q1_D35: QDRII_mem (IC42.P2 RP1.10), FPGA_QDRII (IC33.C15)
Q1_DOFF: QDRII_mem (IC42.H1), FPGA_QDRII (IC33.E19)
Q1_K_N: QDRII_mem (IC42.A6), FPGA_QDRII (IC33.H20)
Q1_K_P: QDRII_mem (IC42.B6), FPGA_QDRII (IC33.H19)
Q1_Q0: QDRII_mem (IC42.P11), FPGA_QDRII (IC33.K21)
Q1_Q1: QDRII_mem (IC42.M10), FPGA_QDRII (IC33.K22)
Q1_Q2: QDRII_mem (IC42.L11), FPGA_QDRII (IC33.B18)
Q1_Q3: QDRII_mem (IC42.K11), FPGA_QDRII (IC33.C18)
Q1_Q4: QDRII_mem (IC42.J10), FPGA_QDRII (IC33.L20)
Q1_Q5: QDRII_mem (IC42.F11), FPGA_QDRII (IC33.L21)
Q1_Q6: QDRII_mem (IC42.E11), FPGA_QDRII (IC33.C22)
Q1_Q7: QDRII_mem (IC42.C10), FPGA_QDRII (IC33.D22)
Q1_Q8: QDRII_mem (IC42.B11), FPGA_QDRII (IC33.D25)
Q1_Q9: QDRII_mem (IC42.P9), FPGA_QDRII (IC33.D26)
Q1_Q10: QDRII_mem (IC42.N9), FPGA_QDRII (IC33.C24)
Q1_Q11: QDRII_mem (IC42.L10), FPGA_QDRII (IC33.C25)
Q1_Q12: QDRII_mem (IC42.K9), FPGA_QDRII (IC33.E26)
Q1_Q13: QDRII_mem (IC42.G9), FPGA_QDRII (IC33.F26)
Q1_Q14: QDRII_mem (IC42.F10), FPGA_QDRII (IC33.B25)
Q1_Q15: QDRII_mem (IC42.E9), FPGA_QDRII (IC33.A25)
Q1_Q16: QDRII_mem (IC42.D9), FPGA_QDRII (IC33.D27)
Q1_Q17: QDRII_mem (IC42.B10), FPGA_QDRII (IC33.B26)
Q1_Q18: QDRII_mem (IC42.B2), FPGA_QDRII (IC33.A26)
Q1_Q19: QDRII_mem (IC42.D3), FPGA_QDRII (IC33.G26)
Q1_Q20: QDRII_mem (IC42.E3), FPGA_QDRII (IC33.G27)
Q1_Q21: QDRII_mem (IC42.F2), FPGA_QDRII (IC33.B27)
Q1_Q22: QDRII_mem (IC42.G3), FPGA_QDRII (IC33.C27)
Q1_Q23: QDRII_mem (IC42.K3), FPGA_QDRII (IC33.D24)
Q1_Q24: QDRII_mem (IC42.L2), FPGA_QDRII (IC33.E24)
Q1_Q25: QDRII_mem (IC42.N3), FPGA_QDRII (IC33.C28)
Q1_Q26: QDRII_mem (IC42.P3), FPGA_QDRII (IC33.B28)
Q1_Q27: QDRII_mem (IC42.B1), FPGA_QDRII (IC33.C29)
Q1_Q28: QDRII_mem (IC42.C2), FPGA_QDRII (IC33.D29)
Q1_Q29: QDRII_mem (IC42.E1), FPGA_QDRII (IC33.F25)
Q1_Q30: QDRII_mem (IC42.F1), FPGA_QDRII (IC33.G25)
Q1_Q31: QDRII_mem (IC42.J2), FPGA_QDRII (IC33.H27)
Q1_Q32: QDRII_mem (IC42.K1), FPGA_QDRII (IC33.G28)
Q1_Q33: QDRII_mem (IC42.L1), FPGA_QDRII (IC33.A28)
Q1_Q34: QDRII_mem (IC42.M2), FPGA_QDRII (IC33.A29)
Q1_Q35: QDRII_mem (IC42.P1), FPGA_QDRII (IC33.F28)
Q1_RPS: QDRII_mem (IC42.A8), FPGA_QDRII (IC33.A19)
Q1_WPS: QDRII_mem (IC42.A4), FPGA_QDRII (IC33.A18)
Q2_A0: QDRII_mem (IC43.B4 RP6.5), FPGA_QDRII (IC33.AJ27)
Q2_A1: QDRII_mem (IC43.B8 RP6.10), FPGA_QDRII (IC33.AM27)
Q2_A2: QDRII_mem (IC43.C5 RP6.7), FPGA_QDRII (IC33.AJ25)
Q2_A3: QDRII_mem (IC43.C6 RP6.8), FPGA_QDRII (IC33.AH25)
Q2_A4: QDRII_mem (IC43.C7 RP6.9), FPGA_QDRII (IC33.AM28)
Q2_A5: QDRII_mem (IC43.N5 RP2.9), FPGA_QDRII (IC33.AN28)
Q2_A6: QDRII_mem (IC43.N6 RP6.3), FPGA_QDRII (IC33.AK28)
Q2_A7: QDRII_mem (IC43.N7 RP6.4), FPGA_QDRII (IC33.AL28)
Q2_A8: QDRII_mem (IC43.P4 RP4.10), FPGA_QDRII (IC33.AP29)
Q2_A9: QDRII_mem (IC43.P5 RP4.9), FPGA_QDRII (IC33.AN29)
Q2_A10: QDRII_mem (IC43.P7 RP4.5), FPGA_QDRII (IC33.AL29)
Q2_A11: QDRII_mem (IC43.P8 RP4.3), FPGA_QDRII (IC33.AP31)
Q2_A12: QDRII_mem (IC43.R3 RP2.10), FPGA_QDRII (IC33.AP30)
Q2_A13: QDRII_mem (IC43.R4 RP2.7), FPGA_QDRII (IC33.AG26)
Q2_A14: QDRII_mem (IC43.R5 RP4.8), FPGA_QDRII (IC33.AG25)
Q2_A15: QDRII_mem (IC43.R7 RP4.7), FPGA_QDRII (IC33.AM30)
Q2_A16: QDRII_mem (IC43.R8 RP4.4), FPGA_QDRII (IC33.AN30)
Q2_A17: QDRII_mem (IC43.R9 RP4.2), FPGA_QDRII (IC33.AH28)
Q2_A18: QDRII_mem (IC43.A9 RP10.5), FPGA_QDRII (IC33.AH27)
Q2_BWS0: QDRII_mem (IC43.B7), FPGA_QDRII (IC33.AC14)
Q2_BWS1: QDRII_mem (IC43.A7), FPGA_QDRII (IC33.AM11)
Q2_BWS2: QDRII_mem (IC43.A5), FPGA_QDRII (IC33.AG13)
Q2_BWS3: QDRII_mem (IC43.B5), FPGA_QDRII (IC33.AL13)
Q2_CQ_N: QDRII_mem (IC43.A1), FPGA_QDRII (IC33.AK27)
Q2_CQ_P: QDRII_mem (IC43.A11), FPGA_QDRII (IC33.AN27)
Q2_D0: QDRII_mem (IC43.P10 RP14.10), FPGA_QDRII (IC33.AE13)
Q2_D1: QDRII_mem (IC43.N11 RP14.9), FPGA_QDRII (IC33.AE12)
Q2_D2: QDRII_mem (IC43.M11 RP14.8), FPGA_QDRII (IC33.AJ11)
Q2_D3: QDRII_mem (IC43.K10 RP14.7), FPGA_QDRII (IC33.AK11)
Q2_D4: QDRII_mem (IC43.J11 RP14.5), FPGA_QDRII (IC33.AD14)
Q2_D5: QDRII_mem (IC43.G11 RP14.4), FPGA_QDRII (IC33.AK12)
Q2_D6: QDRII_mem (IC43.E10 RP14.3), FPGA_QDRII (IC33.AJ12)
Q2_D7: QDRII_mem (IC43.D11 RP14.2), FPGA_QDRII (IC33.AF11)
Q2_D8: QDRII_mem (IC43.C11 RP12.10), FPGA_QDRII (IC33.AE11)
Q2_D9: QDRII_mem (IC43.N10 RP12.9), FPGA_QDRII (IC33.AM10)
Q2_D10: QDRII_mem (IC43.M9 RP12.8), FPGA_QDRII (IC33.AL10)
Q2_D11: QDRII_mem (IC43.L9 RP12.7), FPGA_QDRII (IC33.AG11)
Q2_D12: QDRII_mem (IC43.J9 RP12.5), FPGA_QDRII (IC33.AG10)
Q2_D13: QDRII_mem (IC43.G10 RP12.4), FPGA_QDRII (IC33.AL11)
Q2_D14: QDRII_mem (IC43.F9 RP12.3), FPGA_QDRII (IC33.AJ10)
Q2_D15: QDRII_mem (IC43.D10 RP12.2), FPGA_QDRII (IC33.AH10)
Q2_D16: QDRII_mem (IC43.C9 RP6.2), FPGA_QDRII (IC33.AC13)
Q2_D17: QDRII_mem (IC43.B9 RP10.4), FPGA_QDRII (IC33.AC12)
Q2_D18: QDRII_mem (IC43.B3 RP10.10), FPGA_QDRII (IC33.AD12)
Q2_D19: QDRII_mem (IC43.C3 RP10.9), FPGA_QDRII (IC33.AD11)
Q2_D20: QDRII_mem (IC43.D2 RP10.8), FPGA_QDRII (IC33.AP11)
Q2_D21: QDRII_mem (IC43.F3 RP10.2), FPGA_QDRII (IC33.AP12)
Q2_D22: QDRII_mem (IC43.G2 RP10.7), FPGA_QDRII (IC33.AF13)
Q2_D23: QDRII_mem (IC43.J3 RP10.3), FPGA_QDRII (IC33.AM12)
Q2_D24: QDRII_mem (IC43.L3 RP7.4), FPGA_QDRII (IC33.AN12)
Q2_D25: QDRII_mem (IC43.M3 RP7.3), FPGA_QDRII (IC33.AE14)
Q2_D26: QDRII_mem (IC43.N2 RP7.2), FPGA_QDRII (IC33.AF14)
Q2_D27: QDRII_mem (IC43.C1 RP7.10), FPGA_QDRII (IC33.AN13)
Q2_D28: QDRII_mem (IC43.D1 RP7.9), FPGA_QDRII (IC33.AM13)
Q2_D29: QDRII_mem (IC43.E2 RP7.8), FPGA_QDRII (IC33.AG12)
Q2_D30: QDRII_mem (IC43.G1 RP7.7), FPGA_QDRII (IC33.AH12)
Q2_D31: QDRII_mem (IC43.J1 RP7.5), FPGA_QDRII (IC33.AK13)
Q2_D32: QDRII_mem (IC43.K2 RP2.5), FPGA_QDRII (IC33.AH13)
Q2_D33: QDRII_mem (IC43.M1 RP2.4), FPGA_QDRII (IC33.AH14)
Q2_D34: QDRII_mem (IC43.N1 RP2.3), FPGA_QDRII (IC33.AP14)
Q2_D35: QDRII_mem (IC43.P2 RP2.2), FPGA_QDRII (IC33.AN14)
Q2_DOFF: QDRII_mem (IC43.H1), FPGA_QDRII (IC33.AK26)
Q2_K_N: QDRII_mem (IC43.A6), FPGA_QDRII (IC33.AH24)
Q2_K_P: QDRII_mem (IC43.B6), FPGA_QDRII (IC33.AH23)
Q2_Q0: QDRII_mem (IC43.P11), FPGA_QDRII (IC33.AP24)
Q2_Q1: QDRII_mem (IC43.M10), FPGA_QDRII (IC33.AP25)
Q2_Q2: QDRII_mem (IC43.L11), FPGA_QDRII (IC33.AL24)
Q2_Q3: QDRII_mem (IC43.K11), FPGA_QDRII (IC33.AK23)
Q2_Q4: QDRII_mem (IC43.J10), FPGA_QDRII (IC33.AN24)
Q2_Q5: QDRII_mem (IC43.F11), FPGA_QDRII (IC33.AN25)
Q2_Q6: QDRII_mem (IC43.E11), FPGA_QDRII (IC33.AL25)
Q2_Q7: QDRII_mem (IC43.C10), FPGA_QDRII (IC33.AM25)
Q2_Q8: QDRII_mem (IC43.B11), FPGA_QDRII (IC33.AP26)
Q2_Q9: QDRII_mem (IC43.P9), FPGA_QDRII (IC33.AP27)
Q2_Q10: QDRII_mem (IC43.N9), FPGA_QDRII (IC33.AE21)
Q2_Q11: QDRII_mem (IC43.L10), FPGA_QDRII (IC33.AD21)
Q2_Q12: QDRII_mem (IC43.K9), FPGA_QDRII (IC33.AM18)
Q2_Q13: QDRII_mem (IC43.G9), FPGA_QDRII (IC33.AL18)
Q2_Q14: QDRII_mem (IC43.F10), FPGA_QDRII (IC33.AG22)
Q2_Q15: QDRII_mem (IC43.E9), FPGA_QDRII (IC33.AH22)
Q2_Q16: QDRII_mem (IC43.D9), FPGA_QDRII (IC33.AP19)
Q2_Q17: QDRII_mem (IC43.B10), FPGA_QDRII (IC33.AN18)
Q2_Q18: QDRII_mem (IC43.B2), FPGA_QDRII (IC33.AK22)
Q2_Q19: QDRII_mem (IC43.D3), FPGA_QDRII (IC33.AN19)
Q2_Q20: QDRII_mem (IC43.E3), FPGA_QDRII (IC33.AN20)
Q2_Q21: QDRII_mem (IC43.F2), FPGA_QDRII (IC33.AC20)
Q2_Q22: QDRII_mem (IC43.G3), FPGA_QDRII (IC33.AD20)
Q2_Q23: QDRII_mem (IC43.K3), FPGA_QDRII (IC33.AM20)
Q2_Q24: QDRII_mem (IC43.L2), FPGA_QDRII (IC33.AL20)
Q2_Q25: QDRII_mem (IC43.N3), FPGA_QDRII (IC33.AF19)
Q2_Q26: QDRII_mem (IC43.P3), FPGA_QDRII (IC33.AE19)
Q2_Q27: QDRII_mem (IC43.B1), FPGA_QDRII (IC33.AP20)
Q2_Q28: QDRII_mem (IC43.C2), FPGA_QDRII (IC33.AP21)
Q2_Q29: QDRII_mem (IC43.E1), FPGA_QDRII (IC33.AK19)
Q2_Q30: QDRII_mem (IC43.F1), FPGA_QDRII (IC33.AL19)
Q2_Q31: QDRII_mem (IC43.J2), FPGA_QDRII (IC33.AF20)
Q2_Q32: QDRII_mem (IC43.K1), FPGA_QDRII (IC33.AC19)
Q2_Q33: QDRII_mem (IC43.L1), FPGA_QDRII (IC33.AM23)
Q2_Q34: QDRII_mem (IC43.M2), FPGA_QDRII (IC33.AL23)
Q2_Q35: QDRII_mem (IC43.P1), FPGA_QDRII (IC33.AK21)
Q2_RPS: QDRII_mem (IC43.A8), FPGA_QDRII (IC33.AM26)
Q2_WPS: QDRII_mem (IC43.A4), FPGA_QDRII (IC33.AL26)
QDR2_VTT_GOOD: QDRII_power (IC45.9 R214.1), FPGA_Peripherals_Control (IC33.AM15)
QDRII_200CLK_N: FPGA_Configuration (IC33.B10), SCB_PLLs (R70.1 R74.2)
QDRII_200CLK_P: FPGA_Configuration (IC33.A10), SCB_PLLs (R73.1 R75.2)
QDRII_CLK_N: FPGA_Configuration (IC33.H9), SCB_PLLs (IC16.45)
QDRII_CLK_P: FPGA_Configuration (IC33.J9), SCB_PLLs (IC16.46)
REF_10M: SCB_CLKs (C67.2 R34.2), SCB_PLLs (C188.1)
RS232_FPGA_RXD: Connectors (P2.6), RS232_and_USB_ports (IC31.8)
RS232_FPGA_TXD: Connectors (P2.4), RS232_and_USB_ports (IC31.7)
RS232_MNG.RS232_MNG_RXD: Connectors (J2.3), RS232_and_USB_ports (IC31.13)
RS232_MNG.RS232_MNG_TXD: Connectors (J2.1), RS232_and_USB_ports (IC31.14)
SPI0.SPI0_MISO: CPU_Memory (IC25.8), CPU_IO_Ports (IC1#1.N16)
SPI0.SPI0_MOSI: CPU_Memory (IC25.1), CPU_IO_Ports (IC1#1.N15)
SPI0.SPI0_NPCS0: CPU_Memory (IC25.4 R166.1), CPU_IO_Ports (IC1#1.M17)
SPI0.SPI0_SPCK: CPU_Memory (IC25.2), CPU_IO_Ports (IC1#1.P15)
SPI1.SPI1_MISO: CPU_IO_Ports (IC24.1), FPGA_Peripherals_Control (IC33.AL14)
SPI1.SPI1_MOSI: CPU_IO_Ports (IC24.3), FPGA_Peripherals_Control (IC33.AL15)
SPI1.SPI1_NPCS0: CPU_IO_Ports (IC24.5), FPGA_Peripherals_Control (IC33.AG16)
SPI1.SPI1_SPCK: CPU_IO_Ports (IC24.4), FPGA_Peripherals_Control (IC33.AC18)
USB_5VBus: Connectors (CON1.1 J2.9), RS232_and_USB_ports (R176.1)
USB_DDM: Connectors (CON1.2 J2.13), RS232_and_USB_ports (R171.2 R172.2)
USB_DDP: Connectors (CON1.3 J2.11), RS232_and_USB_ports (R173.2 R174.1)
uTCA_CLK.uTCA_TONGUE2_CLK1_N: Connectors (CN2.12), SCB_PLLs (IC49.7)
uTCA_CLK.uTCA_TONGUE2_CLK1_P: Connectors (CN2.10), SCB_PLLs (IC49.6)
uTCA_CLK.uTCA_TONGUE2_CLK2_N: Connectors (CN2.18), SCB_PLLs (IC16.34)
uTCA_CLK.uTCA_TONGUE2_CLK2_P: Connectors (CN2.16), SCB_PLLs (IC16.33)